# EAGLE design untitled (EAGLE 9.6.2)
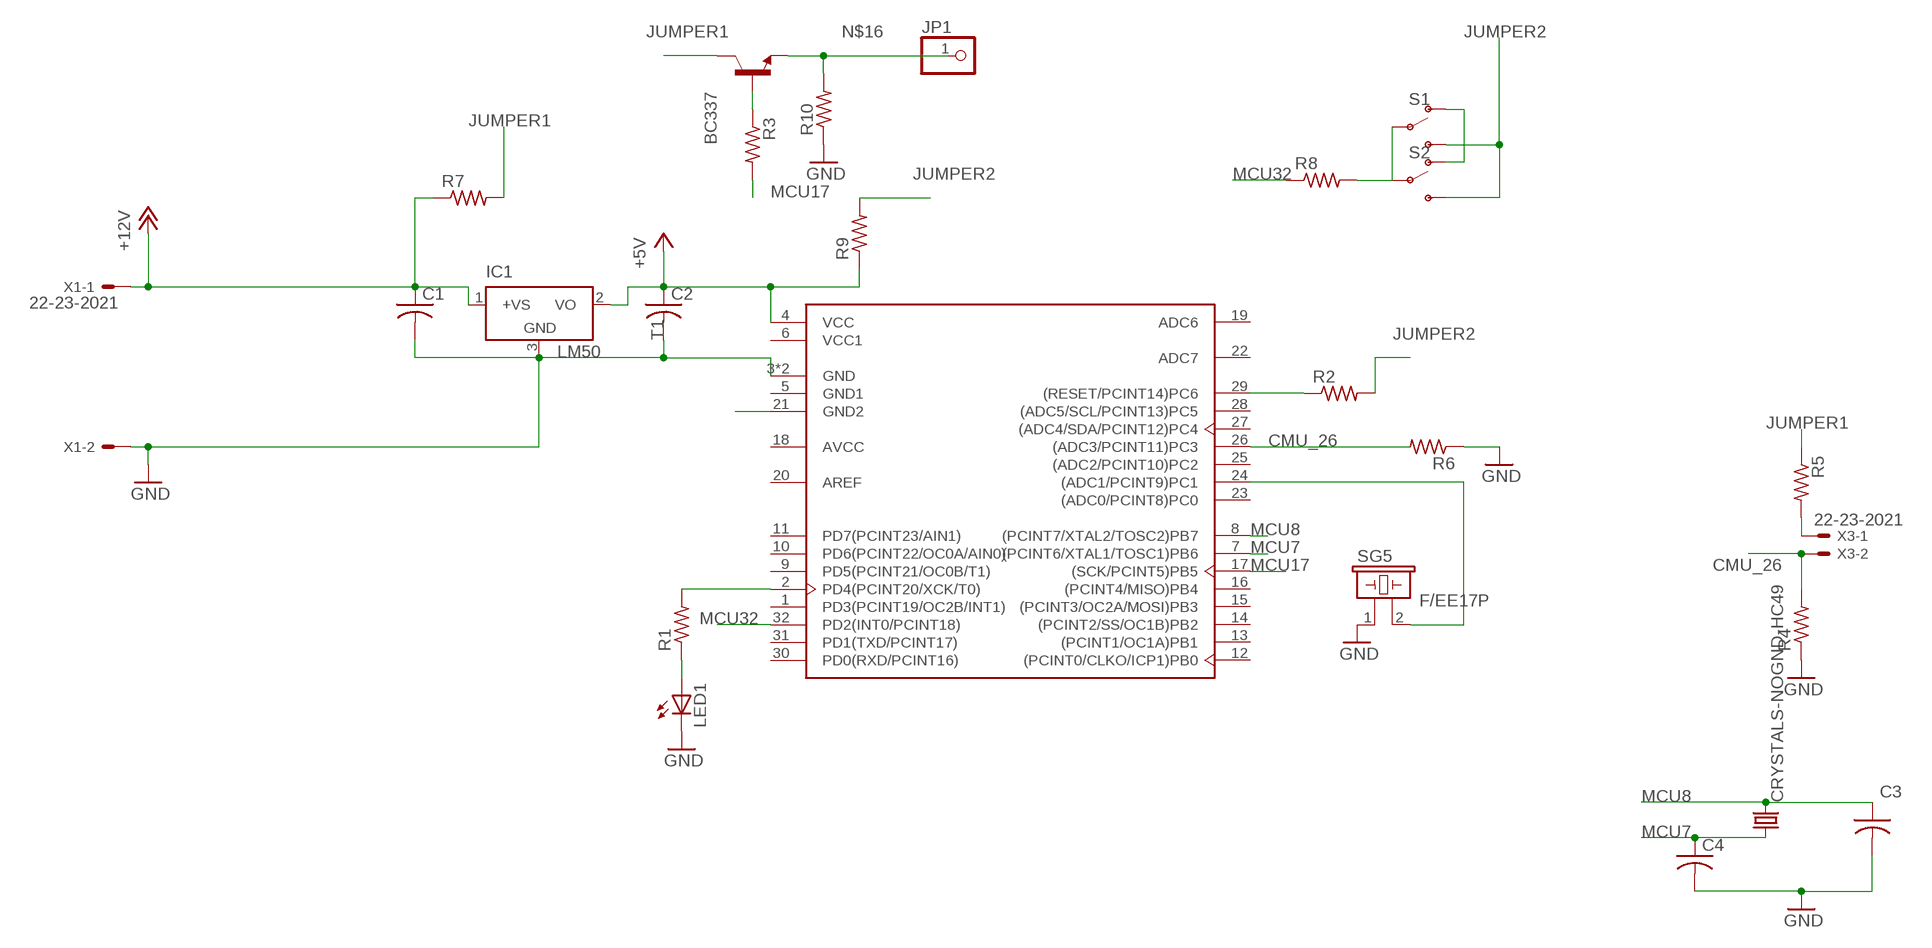
[diagram p0: schematic, sheet 1]

## Parts
C1  C-USC1206K  [C1206K]
C2  C-USC1206K  [C1206K]
C3  C-USC0603K  [C0603K]
C4  C-USC0603K  [C0603K]
IC1  LM50  [SOT23]
JP1  PINHD-1X1  [1X01]
LED1  LED3MM  [LED3MM]
R1  R-US_0204/7  [0204/7]
R2  R-US_R0603  [R0603]
R3  R-US_0204/7  [0204/7]
R4  R-US_0204/7  [0204/7]
R5  R-US_0204/7  [0204/7]
R6  R-US_0204/7  [0204/7]
R7  R-US_0204/7  [0204/7]
R8  R-US_0204/7  [0204/7]
R9  R-US_0204/7  [0204/7]
R10  R-US_0204/7  [0204/7]
S1  SWITCH-SPDT-PTH-11.6X4.0MM-LOCK  [SWITCH_SPDT_PTH_11.6X4.0MM_LOCK]
S2  SWITCH-SPDT-PTH-11.6X4.0MM-LOCK  [SWITCH_SPDT_PTH_11.6X4.0MM_LOCK]
SG5  F/EE17P  [F/EE17P]
T1  BC337  [TO92]
U1  ATMEGA328P-MU  [VQFN-32]
X1  22-23-2021  [22-23-2021]
X2  CRYSTALS-NOGND-HC49  [HC49]
X3  22-23-2021  [22-23-2021]

## Nets
+5V: C2.1 IC1.2(VO) R9.1 U1.4(VCC)
+12V: C1.1 IC1.1(+VS) R7.1 X1.1
CMU_26: R4.2 R6.2 U1.26((ADC3/PCINT11)PC3) X3.2
GND: C1.2 C2.2 C3.2 C4.2 IC1.3(GND) LED1.K(C) R4.1 R6.1 R10.1 SG5.1 U1.3(GND) U1.33(GND) X1.2
JUMPER1: R5.1 R7.2 T1.3(C)
JUMPER2: R2.2 R9.2 S1.3(S) S2.3(S)
MCU7: C4.1 U1.7((PCINT6/XTAL1/TOSC1)PB6) X2.1
MCU8: C3.1 U1.8((PCINT7/XTAL2/TOSC2)PB7) X2.2
MCU17: R3.2 U1.17((SCK/PCINT5)PB5)
MCU32: U1.32(PD2(INT0/PCINT18))
N$2: R8.1
N$6: R1.2 U1.2(PD4(PCINT20/XCK/T0))
N$9: LED1.A R1.1
N$12: R2.1 U1.29((RESET/PCINT14)PC6)
N$14: R3.1 T1.2(B)
N$15: R5.2 X3.1
N$16: JP1.1 R10.2 T1.1(E)
N$18: U1.21(GND2)
N$19: SG5.2 U1.24((ADC1/PCINT9)PC1)
N$21: R8.2 S1.2(P) S2.2(P)
N$22: S1.1(O) S2.1(O)
Unconnected: U1.1(PD3(PCINT19/OC2B/INT1)) U1.9(PD5(PCINT21/OC0B/T1)) U1.10(PD6(PCINT22/OC0A/AIN0)) U1.11(PD7(PCINT23/AIN1)) U1.12((PCINT0/CLKO/ICP1)PB0) U1.13((PCINT1/OC1A)PB1) U1.14((PCINT2/SS/OC1B)PB2) U1.15((PCINT3/OC2A/MOSI)PB3) U1.16((PCINT4/MISO)PB4) U1.19(ADC6) U1.22(ADC7) U1.23((ADC0/PCINT8)PC0) U1.25((ADC2/PCINT10)PC2) U1.27((ADC4/SDA/PCINT12)PC4) U1.28((ADC5/SCL/PCINT13)PC5) U1.30(PD0(RXD/PCINT16)) U1.31(PD1(TXD/PCINT17))

## Power pins joined to a net without a drawn wire
AREF: U1.20(AREF)
AVCC: U1.18(AVCC)
GND1: U1.5(GND1)
VCC1: U1.6(VCC1)

## Library data of the parts
C1-C4 = adafruit:C-US: CAPACITOR, American symbol
IC1 = linear:LM50: SOT-23 Single-Supply Centigrade Temperature Sensor Vout = (10mV/°C x Temp °C) +5mmmV Source: http://cache.national.com/ds/LM/LM50.pdf
JP1 = pinhead:PINHD-1X1: PIN HEADER
LED1 = adafruit:LED: LED OSRAM: - CHIPLED LG R971, LG N971, LY N971, LG Q971, LY Q971, LO R971, LY R971 LH N974, LH R974 LS Q976, LO Q976, LY Q976 LO Q996 - Hyper CHIPLED LW Q18S LB Q993, LB Q99A, LB R99A - SideLED LS A670, LO A670, LY A670, LG A670, LP A670 LB A673, LV A673, LT A673, LW A673 LH A674 LY A675 LS A676, LA A676, LO A676, LY A676, LW A676 LS A679, LY A679, LG A679 - Hyper Micro SIDELED® LS Y876, LA Y876, LO Y876, LY Y876 LT Y87S - SmartLED LW L88C, LW L88S LB L89C, LB L89S, LG L890 LS L89K, LO L89K, LY L89K LS L896, LA L896, LO L896, LY L896 - TOPLED LS T670, LO T670, LY T670, LG T670, LP T670 LSG T670, LSP T670, LSY T670, LOP T670, LYG T670 LG T671, LOG T671, LSG T671 LB T673, LV T673, LT T673, LW T673 LH T674 LS T676, LA T676, LO T676, LY T676, LB T676, LH T676, LSB T676, LW T676 LB T67C, LV T67C, LT T67C, LS T67K, LO T67K, LY T67K, LW E67C LS E67B, LA E67B, LO E67B, LY E67B, LB E67C, LV E67C, LT E67C LW T67C LS T679, LY T679, LG T679 LS T770, LO T770, LY T770, LG T770, LP T770 LB T773, LV T773, LT T773, LW T773 LH T774 LS E675, LA E675, LY E675, LS T675 LS T776, LA T776, LO T776, LY T776, LB T776 LHGB T686 LT T68C, LB T68C - Hyper Mini TOPLED® LB M676 - Mini TOPLED Santana® LG M470 LS M47K, LO M47K, LY M47K Source: http://www.osram.convergy.de/
R1-R10 = adafruit:R-US_: RESISTOR, American symbol
S1 S2 = SparkFun-Switches:SWITCH-SPDT: Single Pole, Double Throw (SPDT) Switch Single-pole, double-throw (SPDT) switch. Variant Overview SMD-AYZ0202 Surface Mount DPDT Switch <https://www.sparkfun.com/products/597> (COM-00597) Used on e.g. LilyPad Arduino USB - ATmega32U4 Board <https://www.sparkfun.com/products/12049> PTH-11.6X4.0MM SPDT Mini Power Switch <https://www.sparkfun.com/products/102> (COM-00102) Used on e.g. SparkFun Simon Says - Through-Hole Soldering Kit <https://www.sparkfun.com/products/10547> (KIT-10547) PTH-11.6X4.0MM-KIT KIT version of SPDT Mini Power Switch - Simplifies soldering by removing tStop of switch pins - only one side can be soldered. PTH-11.6X4.0MM-LOCK LOCK version of SPDT Mini Power Switch - Offset pins hold switch in place for easier soldering. SMD-RIGHT-ANGLE Surface Mount Right Angle Switch <https://www.sparkfun.com/products/10860> (COM-10860) Used on e.g. SparkFun ESP8266 Thing <https://www.sparkfun.com/products/13231>; PROD_ID: SWCH-08261; SF_SKU: COM-00102
SG5 = buzzer:F/EE17P: BUZZER Source: Buerklin; OC_FARNELL: unknown; OC_NEWARK: unknown
T1 = transistor:BC337: NPN TRANSISTOR
U1 = Microcontroller:ATMEGA328P-MU: IC MCU 8BIT 32KB FLASH 32VQFN Manufacturer's datasheet <http://ww1.microchip.com/downloads/en/DeviceDoc/ATmega48A-PA-88A-PA-168A-PA-328-P-DS-DS40002061A.pdf>; CREATED_BY: PCBLayout.com; DIGIKEY_PART_NUMBER: ATMEGA328P-MU-ND; MANUFACTURER: Microchip Technology; MPN: ATMEGA328P-MU; PACKAGE: VQFN-32
X1 X3 = con-molex:22-23-2021: .100" (2.54mm) Center Header - 2 Pin; MF: MOLEX; MPN: 22-23-2021; OC_FARNELL: 1462926; OC_NEWARK: 25C3832
X2 = IQD-Frequency-Products:CRYSTALS-NOGND: CRYSTALS CAN NOT GROUNDED

## Board
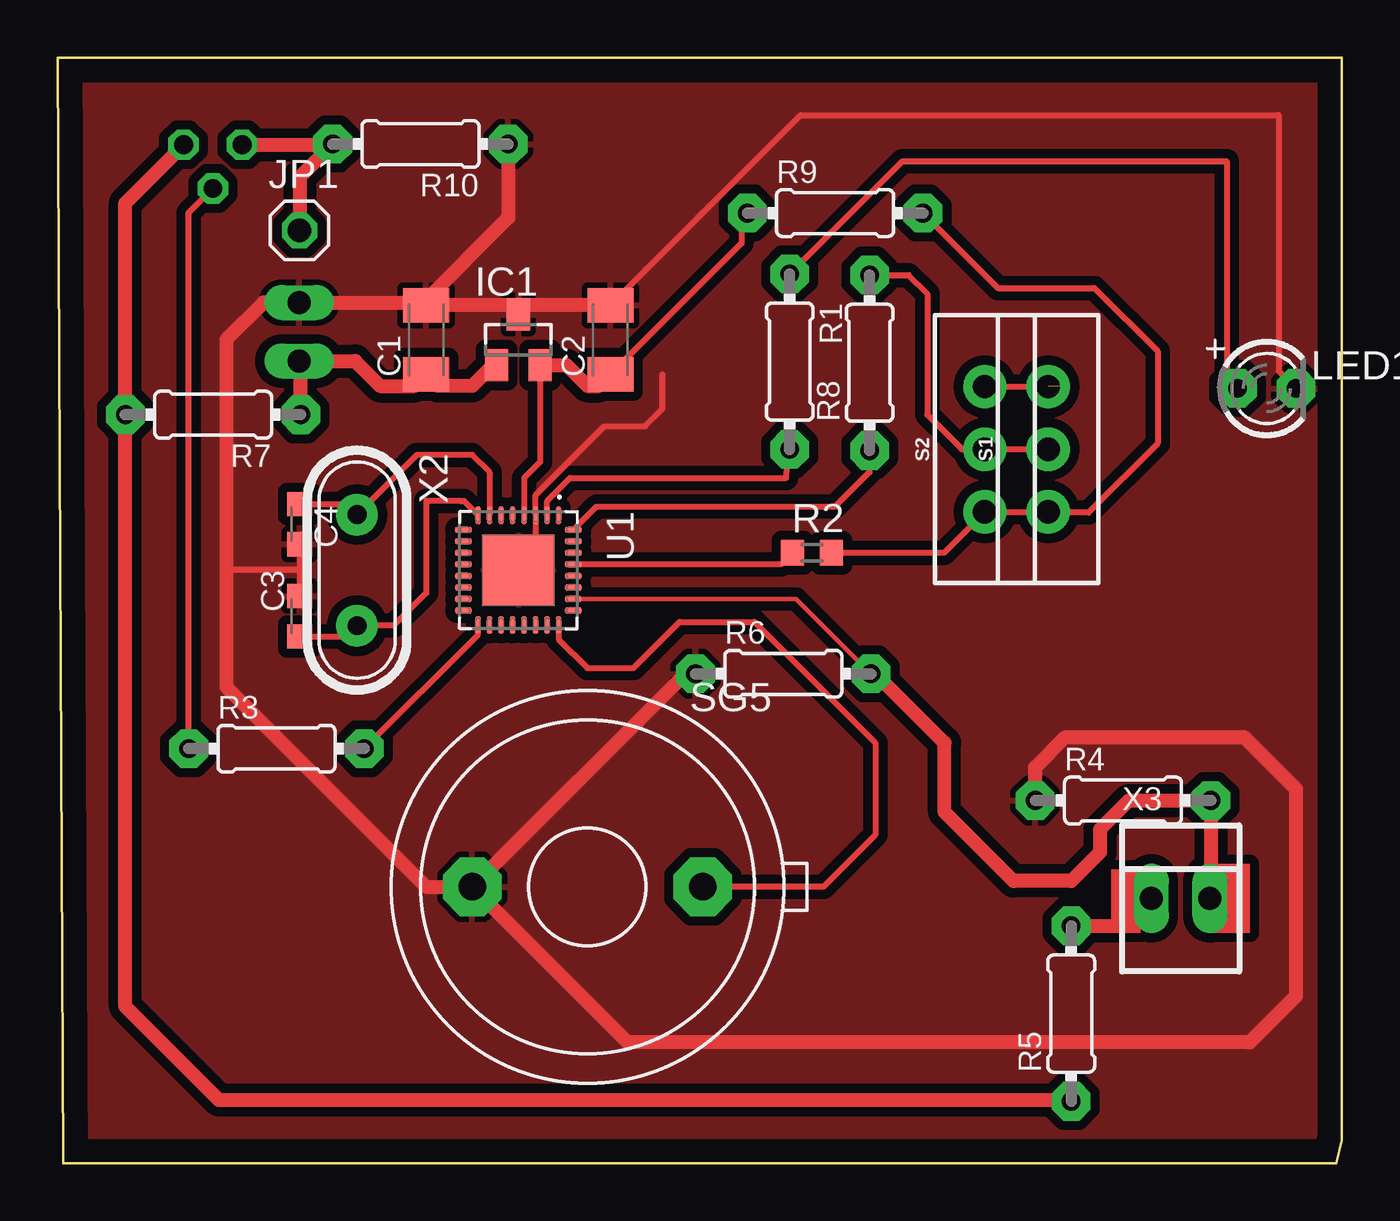
[diagram p1: board, top side]
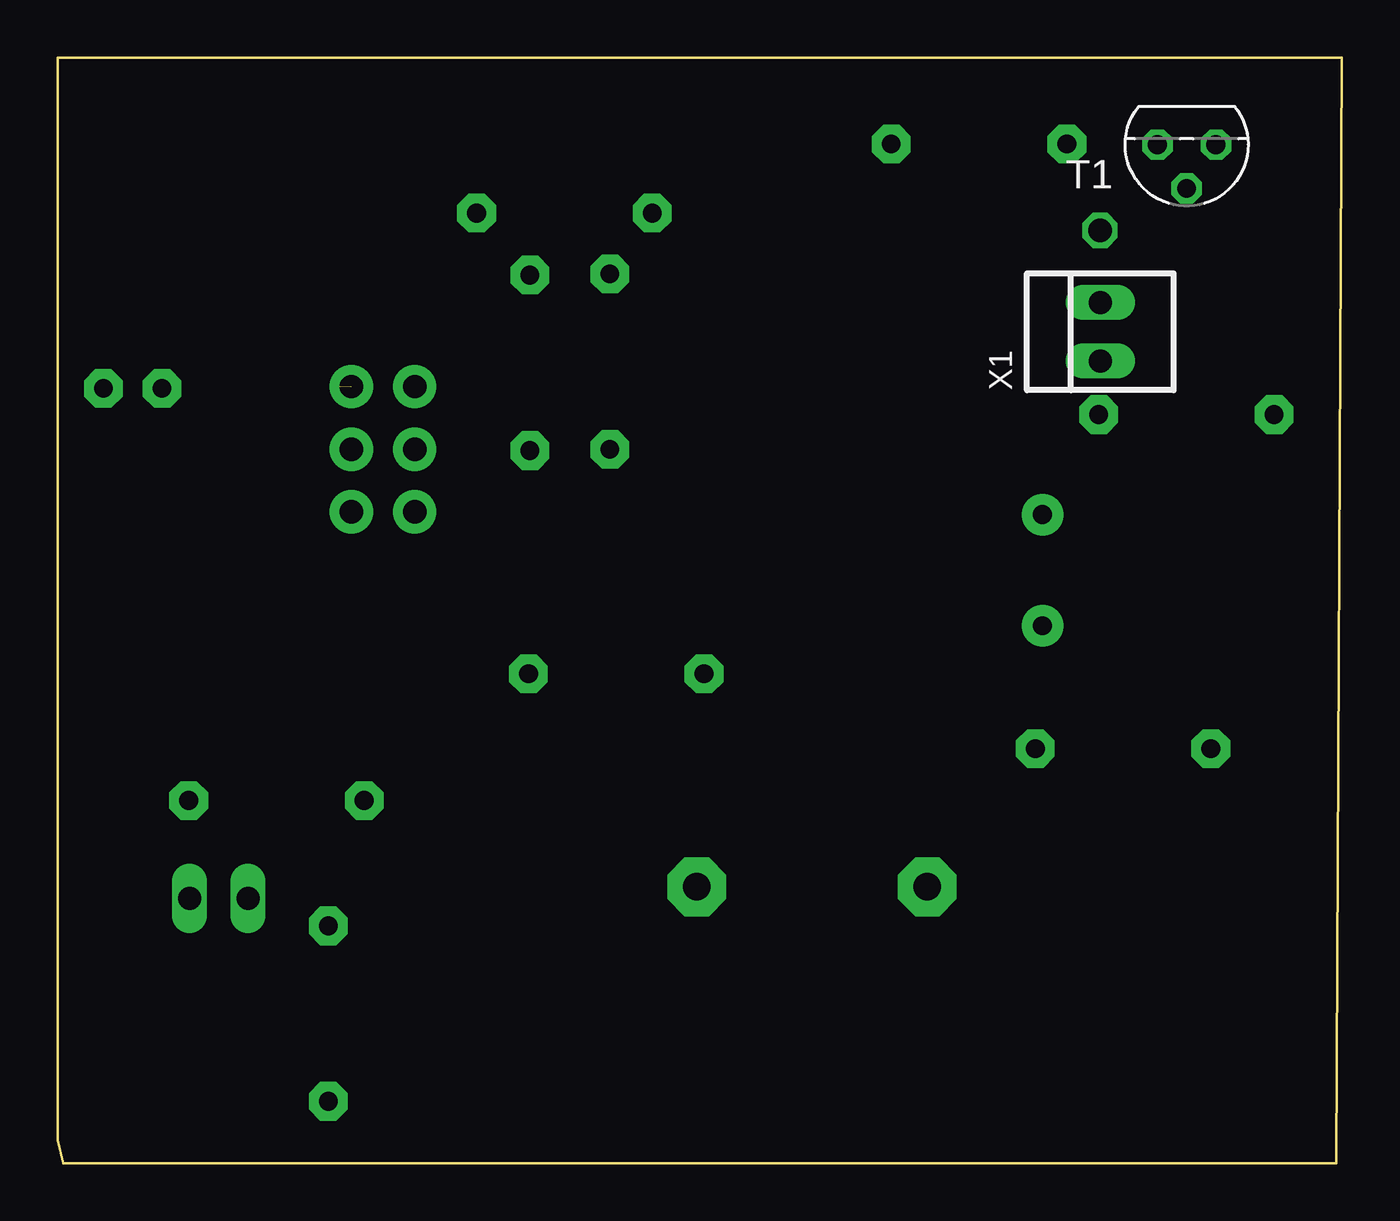
[diagram p2: board, bottom side, seen from below]

Size 55.75 x 48 mm. Coordinates in mm from the lower left corner, seen from the top.
Outline: 0,48 55.75,48 55.75,1 55.5,0 0.25,0 0,48
Copper layers (1*16): Top 0.035mm / dielectric 1.5mm / Bottom 0.035mm
Design rules "default": minimum track width 6mil, minimum drill 0.35mm, track to track 6mil, track to pad 6mil, pad to pad 6mil, via to via 6mil, smd to smd 6mil, copper to edge 40mil, drill to drill 6mil, minimum pad ring 10mil, minimum via ring 8mil, stop-mask expansion 4mil, vias tented up to drill 0mil, thermal gap 10mil

### Footprints (pad centres in the part's own frame; a part is rotated, then mirrored left to right if it is on the bottom)
C1206K = smd 1.5 x 2: 1 -1.5,0; 2 1.5,0
C0603K = smd 1.05 x 1.08: 1 -0.875,0; 2 0.875,0
SOT23 = smd 1 x 1.4: 1 -0.95,-1.1; 2 0.95,-1.1; 3 0,1.1
1X01 = drill 1.016 octagon: 1 0,0
LED3MM = drill 0.813 pad 1.676 octagon: A -1.27,0; K 1.27,0
0204/7 = drill 0.813 pad 1.676 octagon: 1 -3.81,0; 2 3.81,0
R0603 = smd 1 x 1.1: 1 -0.85,0; 2 0.85,0
SWITCH_SPDT_PTH_11.6X4.0MM_LOCK = drill 1.016 pad 1.88: 1 0,2.718; 2 0,0; 3 0,-2.718
F/EE17P = drill 1.194 pad 2.54 octagon: 1 -5.004,0; 2 5.004,0
TO92 = drill 0.813 octagon: 1 1.27,0; 2 0,1.905; 3 -1.27,0
VQFN-32 = smd 0.76 x 0.26: 1 -2.385,1.75; 2 -2.385,1.25; 3 -2.385,0.75; 4 -2.385,0.25; 5 -2.385,-0.25; 6 -2.385,-0.75; 7 -2.385,-1.25; 8 -2.385,-1.75; 17 2.385,-1.75; 18 2.385,-1.25; 19 2.385,-0.75; 20 2.385,-0.25; 21 2.385,0.25; 22 2.385,0.75; 23 2.385,1.25; 24 2.385,1.75 | smd 0.26 x 0.76: 9 -1.75,-2.385; 10 -1.25,-2.385; 11 -0.75,-2.385; 12 -0.25,-2.385; 13 0.25,-2.385; 14 0.75,-2.385; 15 1.25,-2.385; 16 1.75,-2.385; 25 1.75,2.385; 26 1.25,2.385; 27 0.75,2.385; 28 0.25,2.385; 29 -0.25,2.385; 30 -0.75,2.385; 31 -1.25,2.385; 32 -1.75,2.385 | smd 3.1 x 3.1: 33 0,0
22-23-2021 = drill 1 long: 1 -1.27,0; 2 1.27,0
HC49 = drill 0.813 pad 1.8: 1 -2.413,0; 2 2.413,0

### Placement (x,y rotation side)
C1  16,35.75 90 top
C2  24,35.75 90 top
C3  10.5,23.75 90 top
C4  10.5,27.75 270 top
IC1  20,35.75 0 top
JP1  10.5,40.5 0 top
LED1  52.49,33.64 0 top
R1  31.78,34.8 270 top
R2  32.75,26.5 0 top
R3  9.5,18 0 top
R4  46.25,15.75 0 top
R5  44,6.5 90 top
R6  31.5,21.25 0 top
R7  6.75,32.5 180 top
R8  35.25,34.75 90 top
R9  33.75,41.25 0 top
R10  15.75,44.25 180 top
S1  43,31 0 top
S2  40.25,31 0 top
SG5  23,12 0 top
T1  6.74,44.22 180 bottom
U1  20,25.75 270 top
X1  10.49,36.1 90 bottom
X2  13,25.75 270 top
X3  48.75,11.5 0 top

### Tracks (layer width: path | path; a pad name or v marks a point on that pad's centre or on a via)
+5V
  Top 0.254: IC1.2 20.95,30.45 20.25,29.75 U1.4 | C2.1 29.69,39.94 29.69,41 R9.1
  Top 0.61: IC1.2 22.1,34.65 23,33.75 23.5,33.75 C2.1
+12V
  Top 0.61: IC1.1 18.9,34.65 18,33.75 16.5,33.75 C1.1 15.5,33.75 14,33.75 12.92,34.83 X1.1 10.56,34.76 R7.1
CMU_26
  Top 0.2: U1.26 32.06,24.5 R6.2
  Top 0.61: X3.2 50.06,11.54 R4.2 46.5,15.75 45.25,14.5 45.25,13.5 44,12.25 41.5,12.25 38.5,15.25 38.5,18.25 35.5,21.25 R6.2
GND
  Top 0.254: C4.2 10.5,25.75 | 10.5,25.75 C3.2 | 10.5,25.75 7.32,25.75 | 26.25,34.25 26.25,32.75 25.5,32 23.75,32 20.75,29 U1.3 20.75,25.75 20,25 | 24.5,37 24.25,37.25 C2.2 32.25,45.5 53,45.5 53,34.4 LED1.K
  Top 0.61: 15.88,37.37 X1.2 8.94,37.37 7.32,35.75 7.32,25.75 7.32,20.68 16,12 SG5.1 | 15.88,37.37 C1.2 19.6,37.25 | IC1.3 19.6,37.25 | C2.2 19.6,37.25 | R4.1 42.44,17.19 43.75,18.5 51.5,18.5 53.75,16.25 53.75,7.25 51.75,5.25 24.75,5.25 SG5.1 | R6.1 27.25,21.25 SG5.1 | R10.1 19.56,41.05 15.88,37.37
  pour Top (isolate 0.406): 0.25,47.75 0.25,0.25 55.75,0.25 55.75,47.75
JUMPER1
  Top 0.61: R5.1 43.94,2.75 7,2.75 2.94,6.81 R7.2 2.94,41.69 T1.3
JUMPER2
  Top 0.254: R9.2 40.81,38 45,38 47.75,35.25 47.75,31.25 44.75,28.25 43.03,28.25 S1.3 S2.3 38.47,26.5 R2.2
MCU7
  Top 0.254: U1.7 18.75,30 18,30.75 15.59,30.75 X2.1 12.54,28.62 C4.1
MCU8
  Top 0.254: C3.1 12.54,22.88 X2.2 14.59,23.34 16,24.75 16,28.75 17.5,28.75 17.64,28.75 U1.8
MCU17
  Top 0.254: R3.2 18.25,22.94 U1.17
MCU32
  Top 0.254: U1.32 23.39,28.5 33.75,28.5 35.25,30
N$6
  Top 0.254: U1.2 21.25,28.75 22.25,29.75 31.62,29.75 R1.2
N$9
  Top 0.254: R1.1 36.67,43.5 50.75,43.5 50.75,34.11 LED1.A
N$12
  Top 0.254: R2.1 31.4,26 U1.29
N$14
  Top 0.254: 5.19,18.5 R3.1 5.69,41.27 T1.2
N$15
  Top 0.61: R5.2 46.29,10.31 X3.1
N$16
  Top 0.61: T1.1 11.91,44.22 R10.2 10.5,42.81 JP1.1
N$19
  Top 0.254: U1.24 21.75,22.75 23,21.5 25,21.5 27,23.5 30.25,23.5 35.5,18.25 35.5,14.25 33.25,12 SG5.2
N$21
  Top 0.254: R8.2 36.94,38.56 37.75,37.75 37.75,32.5 39.25,31 S2.2 S1.2
N$22  (1 unrouted)
  Top 0.254: S2.1 43.47,33.72 43.5,33.75
(copper drawn outside any net)
  shapes: Top area x2